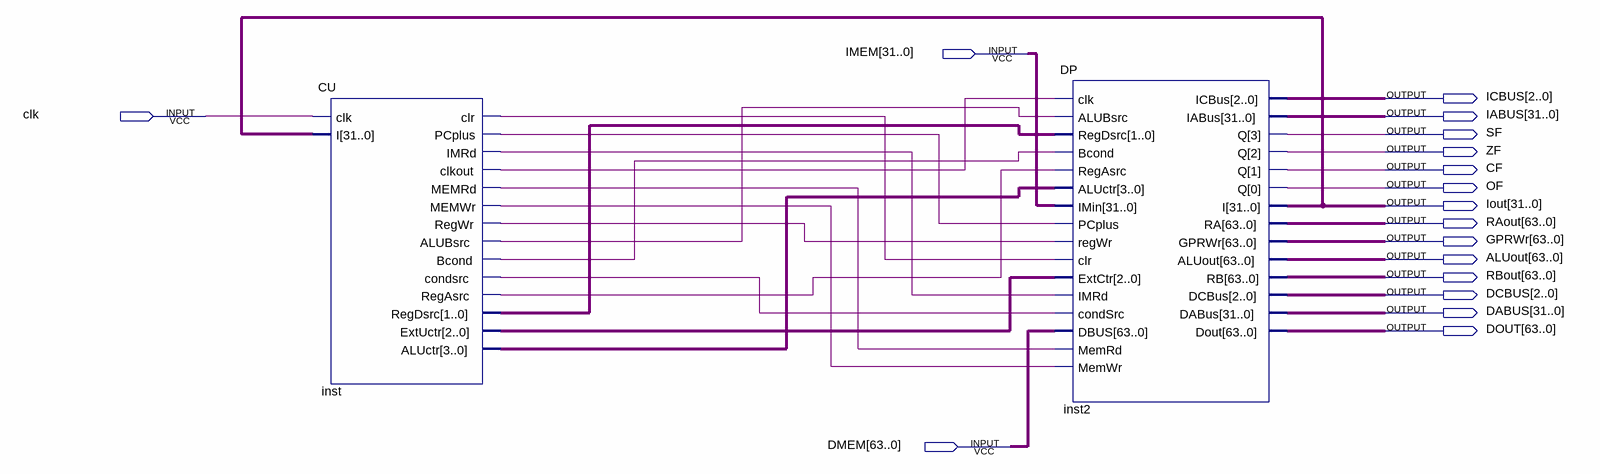
[diagram p0: schematic sheet]
// Quartus schematic CPU.bdf as structural Verilog: 2 symbols, 17 pins
module CPU (
  input  [31:0] IMEM,
  input  clk,
  input  [63:0] DMEM,
  output [2:0] ICBUS,
  output [31:0] IABUS,
  output SF,
  output ZF,
  output CF,
  output OF,
  output [31:0] Iout,
  output [63:0] RAout,
  output [63:0] GPRWr,
  output [63:0] ALUout,
  output [63:0] RBout,
  output [2:0] DCBUS,
  output [31:0] DABUS,
  output [63:0] DOUT
);

  wire inst_alubsrc, inst_bcond, inst_clkout, inst_clr, inst_condsrc, inst_imrd, inst_memrd, inst_memwr,
       inst_pcplus, inst_regasrc, inst_regwr;
  wire [1:0] inst_regdsrc;
  wire [2:0] inst_extuctr;
  wire [3:0] inst_aluctr;

  CU inst (
    .clk(clk), .I(Iout), .clr(inst_clr), .PCplus(inst_pcplus), .IMRd(inst_imrd), .clkout(inst_clkout),
    .MEMRd(inst_memrd), .MEMWr(inst_memwr), .RegWr(inst_regwr), .ALUBsrc(inst_alubsrc), .Bcond(inst_bcond),
    .condsrc(inst_condsrc), .RegAsrc(inst_regasrc), .RegDsrc(inst_regdsrc), .ExtUctr(inst_extuctr),
    .ALUctr(inst_aluctr));
  DP inst2 (
    .clk(inst_clkout), .ALUBsrc(inst_alubsrc), .RegDsrc(inst_regdsrc), .Bcond(inst_bcond),
    .RegAsrc(inst_regasrc), .ALUctr(inst_aluctr), .IMin(IMEM), .PCplus(inst_pcplus), .regWr(inst_regwr),
    .clr(inst_clr), .ExtCtr(inst_extuctr), .IMRd(inst_imrd), .condSrc(inst_condsrc), .DBUS(DMEM),
    .MemRd(inst_memrd), .MemWr(inst_memwr), .ICBus(ICBUS), .IABus(IABUS), .Q({SF, ZF, CF, OF}), .I(Iout),
    .RA(RAout), .GPRWr(GPRWr), .ALUout(ALUout), .RB(RBout), .DCBus(DCBUS), .DABus(DABUS), .Dout(DOUT));
endmodule
